# EAGLE design SensorTesting (EAGLE 9.6.2)
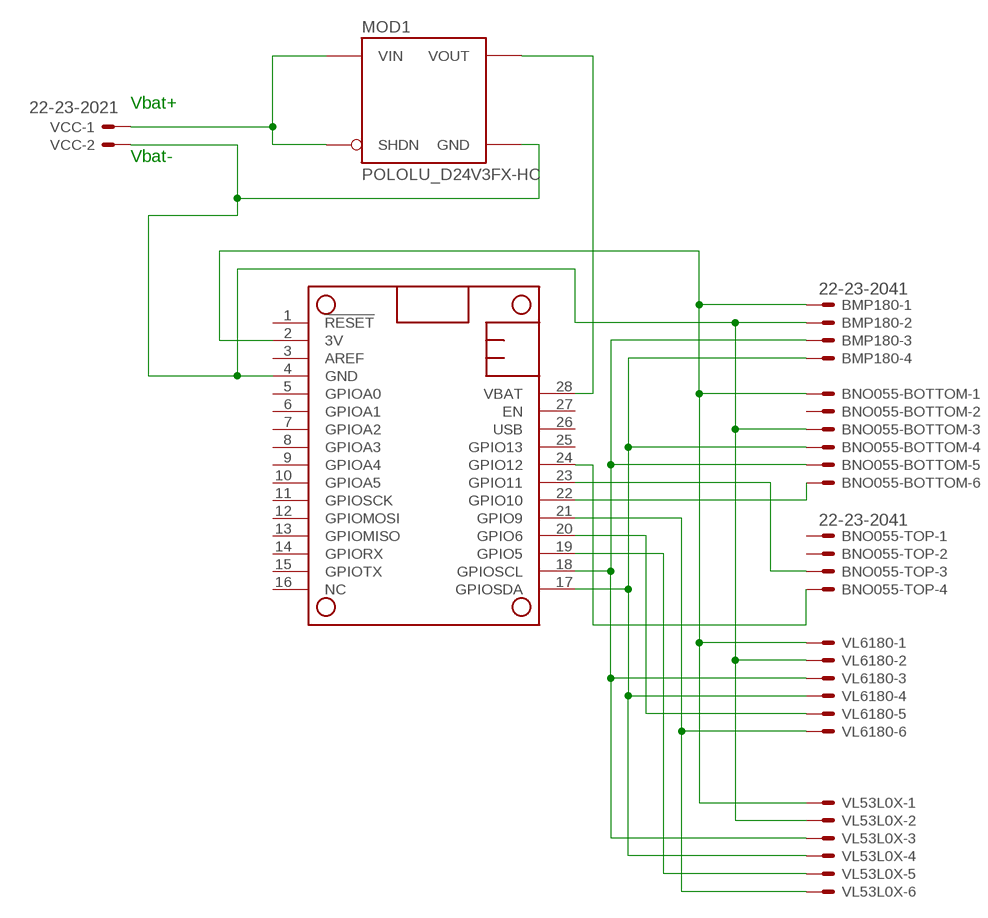
[diagram p0: schematic, sheet 1]

## Parts
BMP180  22-23-2041  [22-23-2041]
BNO055-BOTTOM  22-23-2061  [22-23-2061]
BNO055-TOP  22-23-2041  [22-23-2041]
MOD1  POLOLU_D24V3FX-HC  [POLOLU_D24V3F_HC]
MS1  FEATHERWING_NODIM  [FEATHERWING_DIM]
VCC  22-23-2021  [22-23-2021]
VL53L0X  22-23-2061  [22-23-2061]
VL6180  22-23-2061  [22-23-2061]

## Nets
3V: BMP180.1 BNO055-BOTTOM.1 MS1.2(3V) VL53L0X.1 VL6180.1
N$1: MS1.20(GPIO6) VL6180.5
N$3: BMP180.3 BNO055-BOTTOM.5 MS1.18(GPIOSCL) VL53L0X.3 VL6180.3
N$4: BMP180.4 BNO055-BOTTOM.4 MS1.17(GPIOSDA) VL53L0X.4 VL6180.4
N$5: BNO055-BOTTOM.6 MS1.22(GPIO10)
N$6: BNO055-TOP.3 MS1.23(GPIO11)
N$7: MS1.19(GPIO5) VL53L0X.5
N$8: MS1.21(GPIO9) VL53L0X.6 VL6180.6
N$9: BNO055-TOP.4 MS1.24(GPIO12)
N$11: MOD1.I(VIN) MOD1.S(SHDN) VCC.1
N$13: BMP180.2 BNO055-BOTTOM.3 MOD1.G(GND) MS1.4(GND) VCC.2 VL53L0X.2 VL6180.2
VBAT: MOD1.O(VOUT) MS1.28(VBAT)
Unconnected: BNO055-BOTTOM.2 BNO055-TOP.1 BNO055-TOP.2 MS1.1(!RESET) MS1.3(AREF) MS1.5(GPIOA0) MS1.6(GPIOA1) MS1.7(GPIOA2) MS1.8(GPIOA3) MS1.9(GPIOA4) MS1.10(GPIOA5) MS1.11(GPIOSCK) MS1.12(GPIOMOSI) MS1.13(GPIOMISO) MS1.14(GPIORX) MS1.15(GPIOTX) MS1.16(NC) MS1.25(GPIO13) MS1.26(USB) MS1.27(EN)

## Notes on the sheet
- Vbat+
- Vbat-

## Library data of the parts
BMP180 BNO055-TOP = con-molex:22-23-2041: .100" (2.54mm) Center Header - 4 Pin; MF: MOLEX; MPN: 22-23-2041; OC_FARNELL: 1462920; OC_NEWARK: 38C0355
BNO055-BOTTOM VL53L0X VL6180 = con-molex:22-23-2061: .100" (2.54mm) Center Header - 6 Pin; MF: MOLEX; MPN: 22-23-2061; OC_FARNELL: 1462922; OC_NEWARK: 27C1933
MOD1 = _hhn_Pololu:POLOLU_D24V3F*: Pololu Step Down Voltage Regulators Series D24V3F_ (300 mA) 0.4"x0.5" SOURCE www.pololu.com/ PACKAGE THT; 4-pin (0.1"); 0.4"x0.5" TECHNOLOGIES D24V3F… Vo/V Vi/V (for max. Io) X: (generic) 3: 3.3 3.8 ( 4.3) … 42.0 5: 5.0 6.0 ( 6.5) … 42.0 9: 9.0 10.5 (12.5) … 42.0 12: 12.0 14.0 (17.5) … 42.0 Io: 300 mA; Quiescent Current: 2 mA (SHDN: 20 uA) Author: Dipl.-Ing. FH Rainer Bayer
MS1 = adafruit:FEATHERWING
VCC = con-molex:22-23-2021: .100" (2.54mm) Center Header - 2 Pin; MF: MOLEX; MPN: 22-23-2021; OC_FARNELL: 1462926; OC_NEWARK: 25C3832

## Board
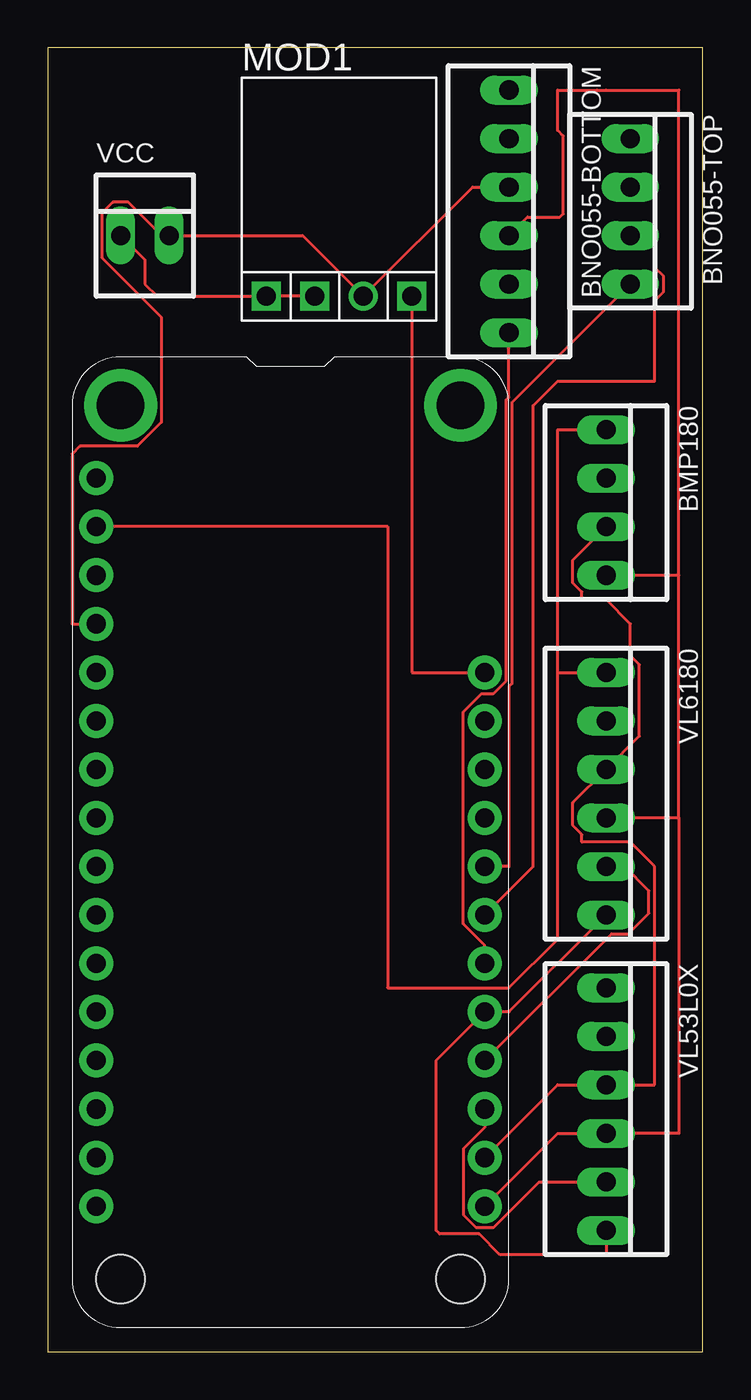
[diagram p1: board, top side]
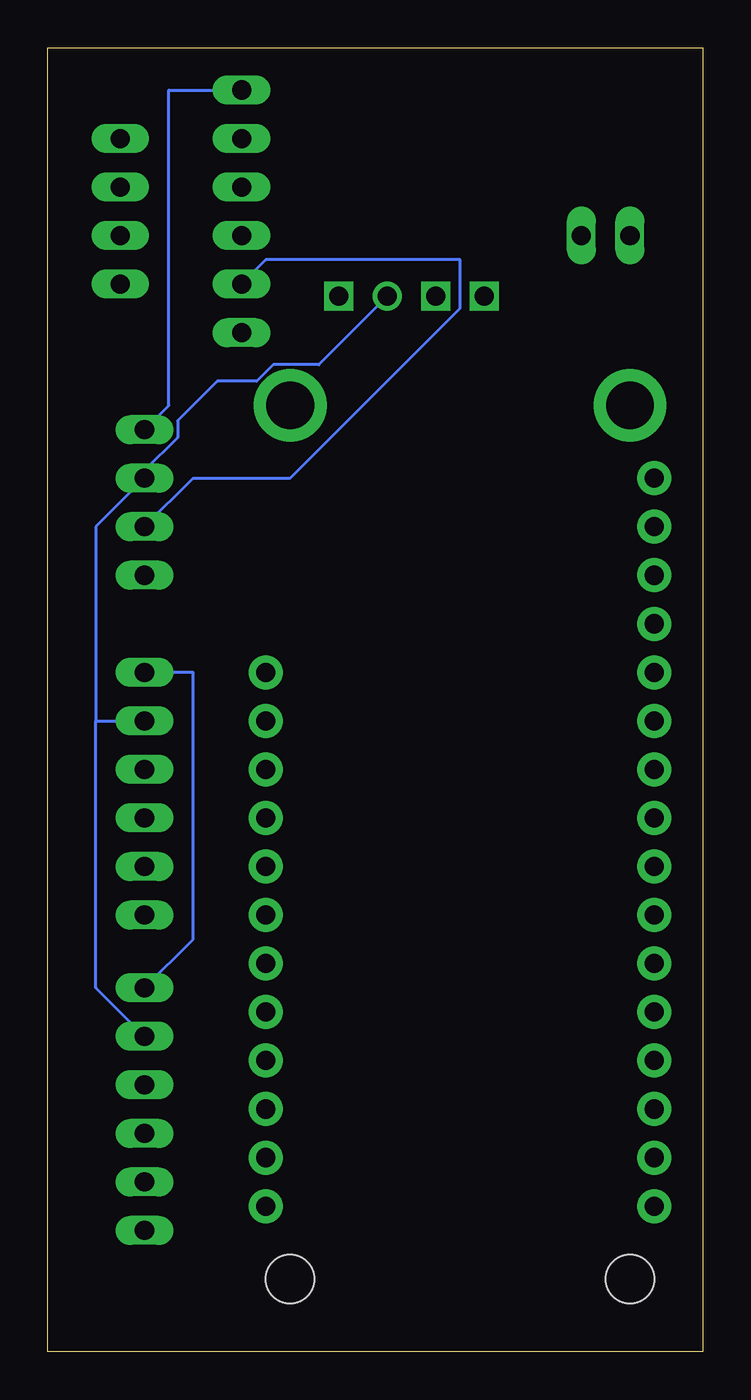
[diagram p2: board, bottom side, seen from below]

Size 34.27 x 68.25 mm. Coordinates in mm from the lower left corner, seen from the top.
Outline: 0,0 34.27,0 34.27,68.25 0,68.25 0,0
Copper layers (1*16): Top 0.035mm / dielectric 1.5mm / Bottom 0.035mm
Design rules "default": minimum track width 6mil, minimum drill 0.35mm, track to track 6mil, track to pad 6mil, pad to pad 6mil, via to via 6mil, smd to smd 6mil, copper to edge 40mil, drill to drill 6mil, minimum pad ring 10mil, minimum via ring 8mil, stop-mask expansion 4mil, vias tented up to drill 0mil, thermal gap 10mil

### Footprints (pad centres in the part's own frame; a part is rotated, then mirrored left to right if it is on the bottom)
22-23-2041 = drill 1 long: 1 -3.81,0; 2 -1.27,0; 3 1.27,0; 4 3.81,0
22-23-2061 = drill 1 long: 1 -6.35,0; 2 -3.81,0; 3 -1.27,0; 4 1.27,0; 5 3.81,0; 6 6.35,0
POLOLU_D24V3F_HC = drill 1: G 1.27,-5.715 | drill 1 square: I -1.27,-5.715; O 3.81,-5.715; S -3.81,-5.715
FEATHERWING_DIM = drill 1 pad 1.778: 1 6.35,1.27; 2 8.89,1.27; 3 11.43,1.27; 4 13.97,1.27; 5 16.51,1.27; 6 19.05,1.27; 7 21.59,1.27; 8 24.13,1.27; 9 26.67,1.27; 10 29.21,1.27; 11 31.75,1.27; 12 34.29,1.27; 13 36.83,1.27; 14 39.37,1.27; 15 41.91,1.27; 16 44.45,1.27; 17 44.45,21.59; 18 41.91,21.59; 19 39.37,21.59; 20 36.83,21.59; 21 34.29,21.59; 22 31.75,21.59; 23 29.21,21.59; 24 26.67,21.59; 25 24.13,21.59; 26 21.59,21.59; 27 19.05,21.59; 28 16.51,21.59 | drill 2.5 pad 3.81: P$1 2.54,20.32; P$2 2.54,2.54 | hole 2.54: 48.26,20.32; 48.26,2.54
22-23-2021 = drill 1 long: 1 -1.27,0; 2 1.27,0

### Placement (x,y rotation side)
BMP180  29.21,44.45 270 top
BNO055-BOTTOM  24.13,59.69 270 top
BNO055-TOP  30.48,59.69 270 top
MOD1  15.24,60.96 0 top
MS1  1.27,52.07 270 top
VCC  5.08,58.42 0 top
VL53L0X  29.21,12.7 270 top
VL6180  29.21,29.21 270 top

### Tracks (layer width: path | path; a pad name or v marks a point on that pad's centre or on a via)
3V
  Top 0.152: BMP180.1 26.67,48.26 26.67,35.56 | MS1.2 17.78,43.18 17.78,19.05 24.13,19.05 26.67,21.59 26.67,35.56 | 26.67,35.56 VL6180.1
  Bottom 0.152: BMP180.1 27.94,49.53 27.94,66.04 BNO055-BOTTOM.1 | VL53L0X.1 26.67,21.59 26.67,35.56 VL6180.1
N$1
  Top 0.152: MS1.20 29.5,21.88 30.37,21.88 31.45,22.95 31.45,24.13 30.18,25.4 VL6180.5
N$3
  Top 0.152: MS1.18 26.67,13.97 VL53L0X.3 31.75,13.97 31.75,25.4 30.48,26.67 27.94,26.67 27.94,27.07 27.47,27.53 27.47,28.74 VL6180.3 30.95,32.22 30.95,35.97 30.48,36.43 30.48,38.1 29.21,39.37 27.94,39.37 27.94,39.77 27.47,40.23 27.47,41.44 BMP180.3
  Bottom 0.152: BMP180.3 26.67,45.72 21.59,45.72 12.7,54.61 12.7,57.15 22.86,57.15 BNO055-BOTTOM.5
N$4
  Top 0.152: MS1.17 26.67,11.43 VL53L0X.4 33.02,11.43 33.02,27.94 | 33.02,27.94 VL6180.4 | 24.13,58.82 BNO055-BOTTOM.4 25.09,59.38 26.8,59.38 26.98,59.56 26.98,63.63 26.67,63.93 26.67,66.04 28.74,66.04 29.21,66.04 33.02,66.04 33.02,40.64 | 33.02,27.94 33.02,40.64 | BMP180.4 33.02,40.64
N$5
  Top 0.152: MS1.22 22.86,21.28 21.74,22.4 21.74,33.48 22.7,34.44 23.32,34.44 23.98,35.1 23.98,49.81 24.13,49.96 BNO055-BOTTOM.6
N$6
  Top 0.152: MS1.23 25.4,25.4 25.4,49.53 26.67,50.8 31.75,50.8 31.75,55.01 32.22,55.47 32.22,56.29 31.75,56.75 31.75,58.42 BNO055-TOP.3
N$7
  Top 0.152: VL53L0X.5 25.71,8.89 23.32,6.5 22.4,6.5 21.74,7.16 21.74,10.62 22.86,11.74 MS1.19
N$8
  Top 0.152: VL53L0X.6 29.21,5.08 23.66,5.08 22.57,6.17 20.5,6.17 20.32,6.35 20.32,15.24 MS1.21 24.13,17.78 VL6180.6
N$9
  Top 0.152: BNO055-TOP.4 24.28,49.68 24.28,34.97 24.13,34.82 24.13,25.4 MS1.24
N$11
  Top 0.152: VCC.1 5.08,57.15 5.08,55.88 5.71,55.24 MOD1.S MOD1.I
N$13
  Top 0.152: MS1.4 1.27,38.1 1.27,46.99 1.68,47.4 4.69,47.4 5.94,48.65 5.94,54.14 2.83,57.26 2.83,59.58 3.4,60.16 4.22,60.16 5.95,58.42 VCC.2 13.34,58.42 MOD1.G 22.23,60.96 BNO055-BOTTOM.3
  Bottom 0.152: MOD1.G 20.09,51.66 22.47,51.66 23.34,50.8 25.4,50.8 27.47,48.73 27.47,47.85 29.21,46.12 BMP180.2 31.75,43.18 31.75,33.02 | VL53L0X.2 31.75,19.05 31.75,33.02 | 31.75,33.02 VL6180.2
VBAT
  Top 0.152: MOD1.O 19.05,35.56 MS1.28